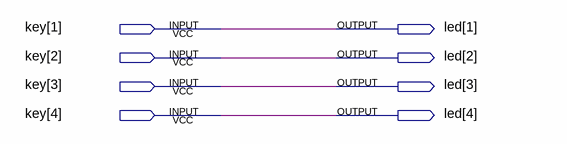
[diagram p0: schematic sheet]
// Quartus schematic vhdlProject.bdf as structural Verilog: 0 symbols, 8 pins
module vhdlProject (
  input  [4:1] key,
  output [4:1] led
);


  assign led = key;
endmodule
